# Altium project ChargeLevel.PrjPcb
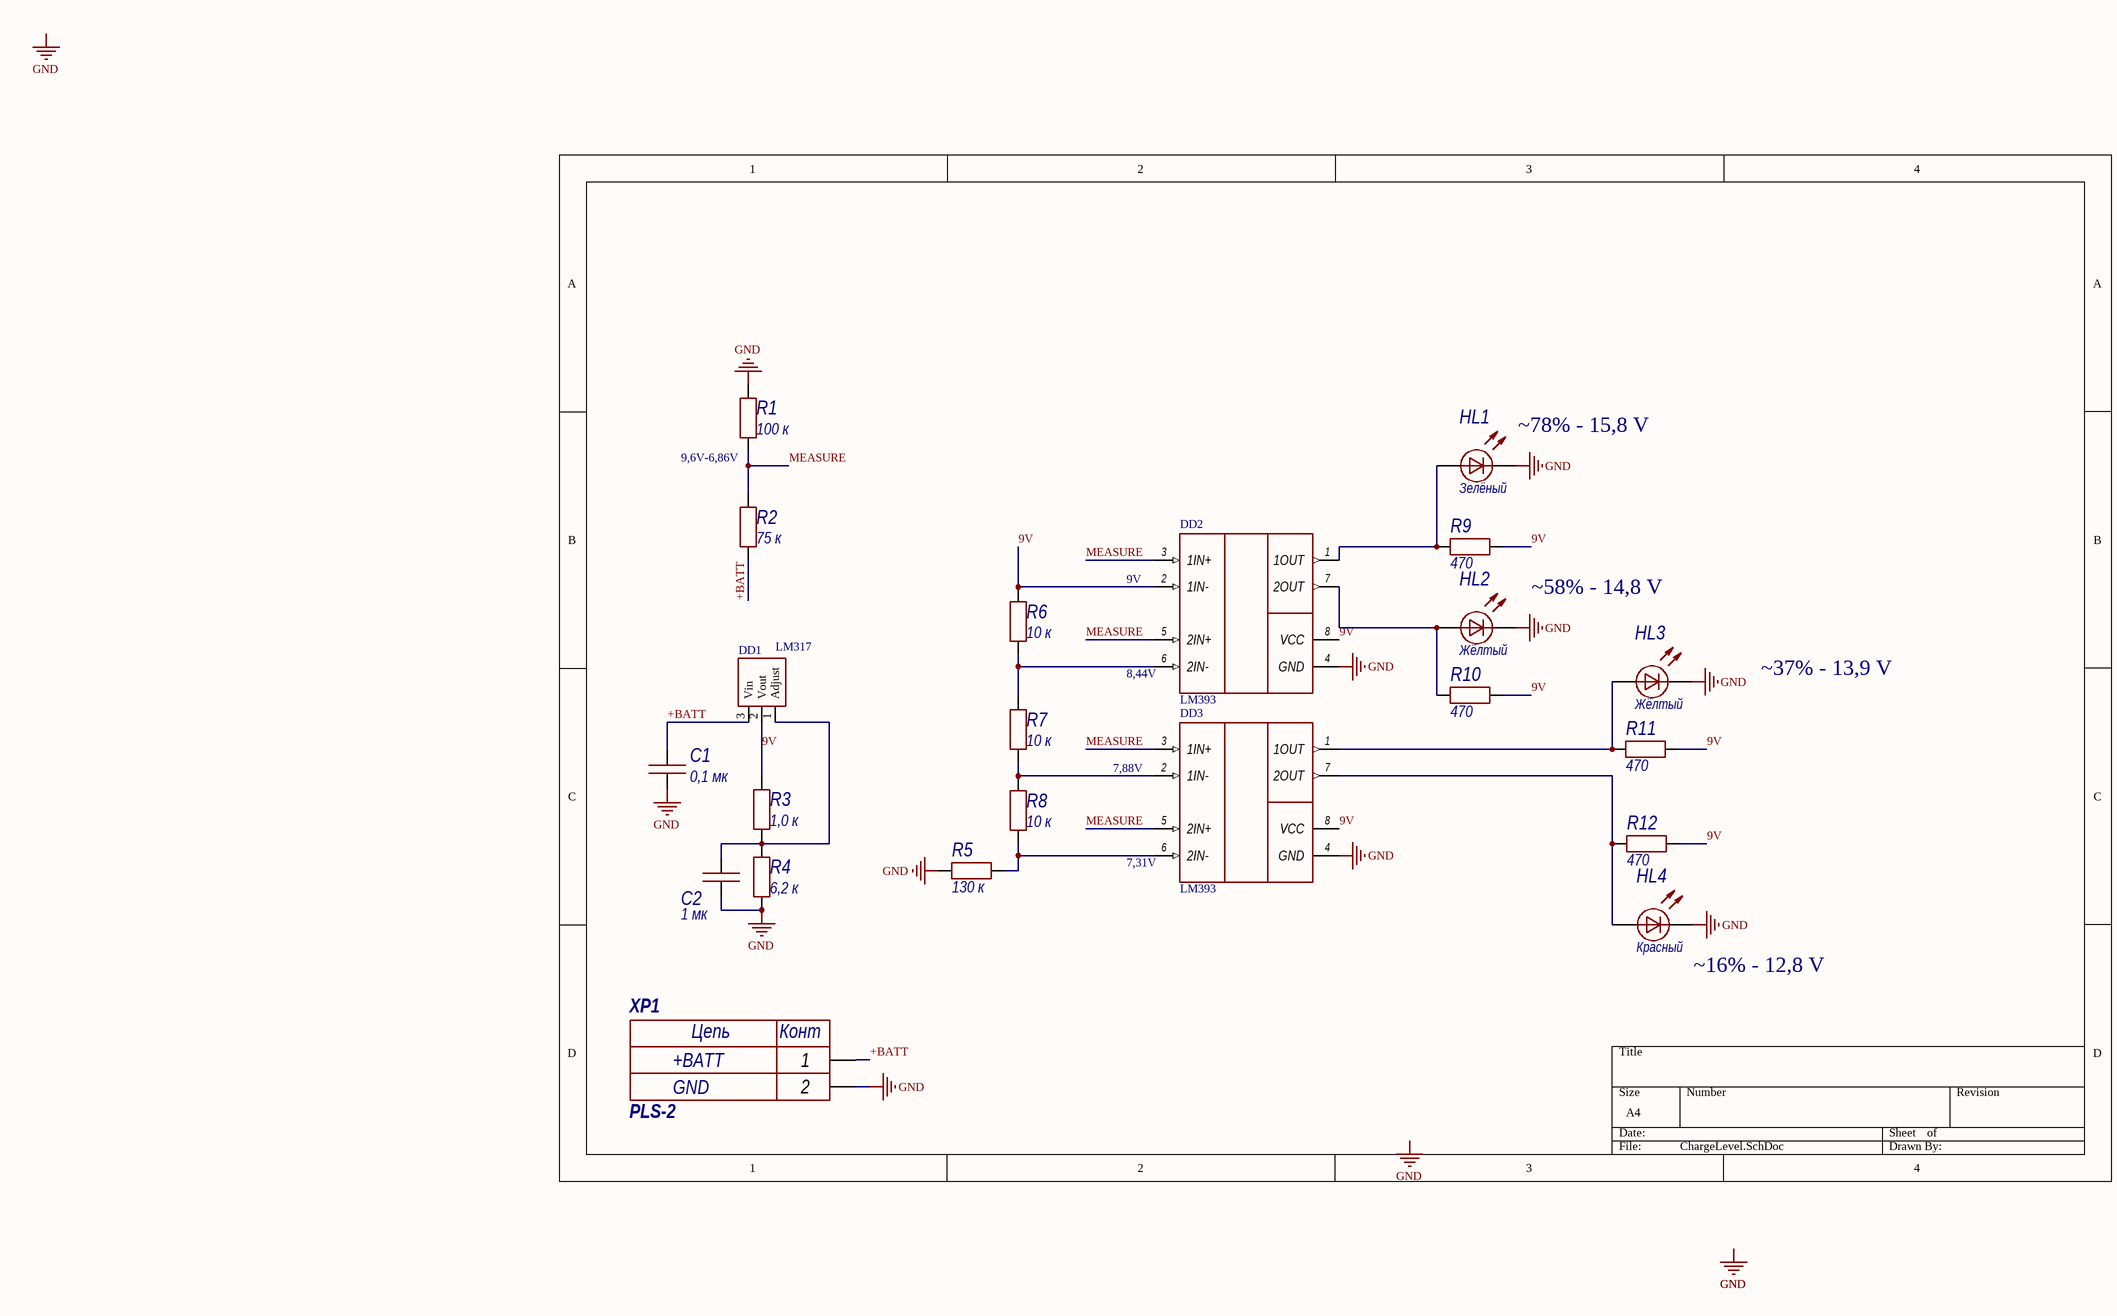
[diagram p0: ChargeLevel.SchDoc]
1 sheet, 22 parts. Net scope: global (net labels, ports and power ports of the same name join across sheets).
Board file: ChargeLevel.PcbDoc

## Sheet ChargeLevel.SchDoc
size A4; SheetNumber: 1; SheetTotal: 1

### Parts
C1  value 0,1 мк  [0603C]  (hidden comment: Capacitor)
C2  value 1 мк  [0603C]  (hidden comment: Capacitor)
DD1  LM317  [TO-220]
DD2  LM393  [SOIC-8]
DD3  LM393  [SOIC-8]
HL1  value Зелёный  [0603D_green]  (hidden comment: LED 0603 GREEN)
HL2  value Жёлтый  [0603D_yellow]  (hidden comment: LED 0603 YELLOW)
HL3  value Жёлтый  [0603D_yellow]  (hidden comment: LED 0603 YELLOW)
HL4  value Красный  [0603D_red]  (hidden comment: LED 0603 RED)
R1  value 100 к  [0603R]  (hidden comment: Resistor)
R2  value 75 к  [0603R]  (hidden comment: Resistor)
R3  value 1,0 к  [0603R]  (hidden comment: Resistor)
R4  value 6,2 к  [0603R]  (hidden comment: Resistor)
R5  value 130 к  [0603R]  (hidden comment: Resistor)
R6  value 10 к  [0603R]  (hidden comment: Resistor)
R7  value 10 к  [0603R]  (hidden comment: Resistor)
R8  value 10 к  [0603R]  (hidden comment: Resistor)
R9  value 470  [0603R]  (hidden comment: Resistor)
R10  value 470  [0603R]  (hidden comment: Resistor)
R11  value 470  [0603R]  (hidden comment: Resistor)
R12  value 470  [0603R]  (hidden comment: Resistor)
XP1  PLS-2  Value2: GND  Value1: +BATT  [PLS2]

### Nets
GND: C1.2 C2.2 DD2.4(GND) DD3.4(GND) HL1.2 HL2.2 HL3.2 HL4.2 R1.2 R4.1 R5.1 XP1.2
9V: DD1.2(Vout) DD2.2(1IN-) DD2.8(VCC) DD3.8(VCC) R3.2 R6.2 R9.2 R10.2 R11.2 R12.2
+BATT: C1.1 DD1.3(Vin) R2.1 XP1.1
MEASURE: DD2.3(1IN+) DD2.5(2IN+) DD3.3(1IN+) DD3.5(2IN+) R1.1 R2.2
NetC2_1: C2.1 DD1.1(Adjust) R3.1 R4.2
NetDD2_1: DD2.1(1OUT) HL1.1 R9.1
NetDD2_6: DD2.6(2IN-) R6.1 R7.2
NetDD2_7: DD2.7(2OUT) HL2.1 R10.1
NetDD3_1: DD3.1(1OUT) HL3.1 R11.1
NetDD3_2: DD3.2(1IN-) R7.1 R8.2
NetDD3_6: DD3.6(2IN-) R5.2 R8.1
NetDD3_7: DD3.7(2OUT) HL4.1 R12.1

### Notes on the sheet
- (near R1) 9,6V-6,86V
- (near HL1) ~78% - 15,8 V
- (near DD2) 9V
- ~58% - 14,8 V
- (near DD2) 8,44V
- ~37% - 13,9 V
- (near DD3) 7,88V
- (near DD3) 7,31V
- (near HL4) ~16% - 12,8 V
- Labels drawn without touching a wire or pin: GND
- (in symbol PLS-2) Цепь; Конт

### Library data of the parts
C1 C2 = 0,1 мк: Конденсатор; Part Number: Capacitor
DD2 DD3 = LM393: Двойной маломощный компаратор напряжения; MF: Texas Instruments; MP: LM393D; Автор: rreali; SnapEDA_Link: https://www.snapeda.com/parts/LM393D/Texas+Instruments/view-part/?ref=snap; Package: SOIC-8 Texas Instruments; Value: *; Check_prices: https://www.snapeda.com/parts/LM393D/Texas+Instruments/view-part/?ref=eda; Part Number: LM393
HL1 = LED 0603 GREEN: Светодиод 0603 Зелёный; Автор: rreali; Part Number: LED 0603 GREEN
HL2 HL3 = LED 0603 YELLOW: Светодиод 0603 Жёлтый; Автор: rreali; Part Number: LED 0603 YELLOW
HL4 = LED 0603 RED: Светодиод 0603 Красный; Автор: rreali; Part Number: LED 0603 RED
R1 = Resistor_100k_1_0603: Резистор номиналом 100 кОм 1%; Power: *; Part Number: Resistor_100k_1_0603; Tolerance: 1%
R2 = Resistor_75k_1_0603: Резистор номиналом 75 кОм 1%; Power: *; Part Number: Resistor_75k_1_0603; Tolerance: 1%
R3 = Resistor_1.0k_1_0603: Резистор номиналом 1,0 кОм 1%; Power: *; Part Number: Resistor_1.0k_1_0603; Tolerance: 1%
R4 = Resistor_6.2k_1_0603: Резистор номиналом 6,2 кОм 1%; Power: *; Part Number: Resistor_6.2k_1_0603; Tolerance: 1%
R5 = Resistor_130k_1_0603: Резистор номиналом 130 кОм 1%; Power: *; Part Number: Resistor_130k_1_0603; Tolerance: 1%
R6-R8 = Resistor_10k_1_0603: Резистор номиналом 10 кОм 1%; Power: *; Part Number: Resistor_10k_1_0603; Tolerance: 1%
R9-R12 = Resistor_470_1_0603: Резистор номиналом 470 Ом 1%; Power: *; Part Number: Resistor_470_1_0603; Tolerance: 1%
XP1 = PLS-2: Гребенка 2 пина; System: Connector; Автор: rreali; Part Number: PLS-2